# EAGLE design 9mm_mount (EAGLE 7.5.0)
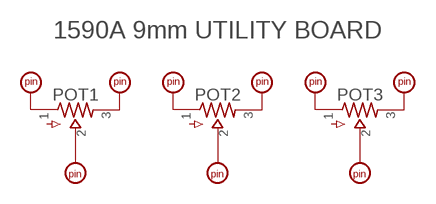
[diagram p0: schematic, sheet 1]

## Parts
PAD1  PAD  [UNLABELED]
PAD2  PAD  [UNLABELED]
PAD3  PAD  [UNLABELED]
PAD4  PAD  [UNLABELED]
PAD5  PAD  [UNLABELED]
PAD6  PAD  [UNLABELED]
PAD7  PAD  [UNLABELED]
PAD8  PAD  [UNLABELED]
PAD9  PAD  [UNLABELED]
POT1  POTS9MM_VERT_ALT  [9MM_VERT_ALT]
POT2  POTS9MM_VERT_ALT  [9MM_VERT_ALT]
POT3  POTS9MM_VERT_ALT  [9MM_VERT_ALT]

## Nets
N$1: PAD1.P$1 POT1.1
N$2: PAD2.P$1 POT1.3
N$3: PAD3.P$1 POT2.1
N$4: PAD4.P$1 POT2.3
N$5: PAD5.P$1 POT3.1
N$6: PAD6.P$1 POT3.3
N$7: PAD7.P$1 POT1.2
N$8: PAD8.P$1 POT2.2
N$9: PAD9.P$1 POT3.2

## Notes on the sheet
- 1590A 9mm UTILITY BOARD

## Library data of the parts
PAD1-PAD9 = supply pins:PAD
POT1-POT3 = potentiometers:POTS

## Board
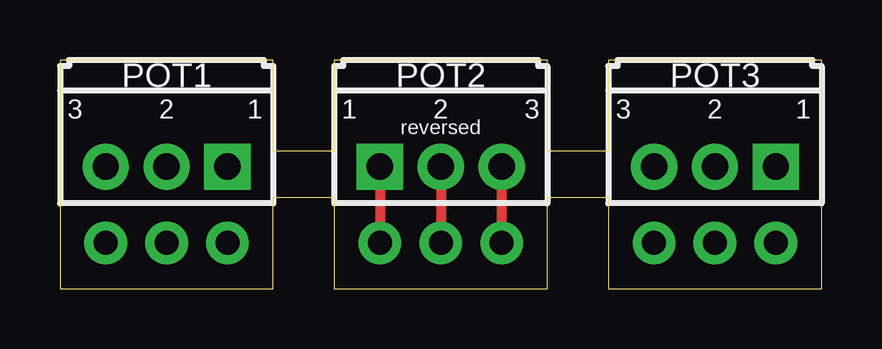
[diagram p1: board, top side]
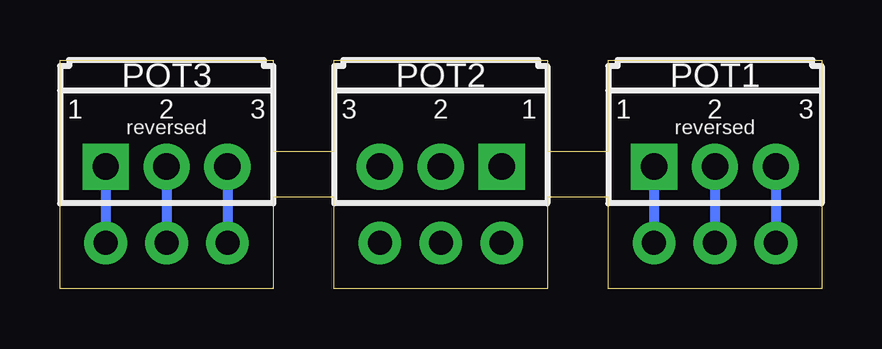
[diagram p2: board, bottom side, seen from below]

Size 31.75 x 9.53 mm. Coordinates in mm from the lower left corner, seen from the top.
Outline: 0,0 8.89,0 8.89,3.81 11.43,3.81 11.43,0 20.32,0 20.32,3.81 22.86,3.81 22.86,0 31.75,0 31.75,9.53 22.86,9.53 22.86,5.71 20.32,5.71 20.32,9.53 11.43,9.53 11.43,5.71 8.89,5.71 8.89,9.53 0,9.53 0,0
Copper layers (1*16): Top 0.0356mm / dielectric 1.5011mm / Bottom 0.0356mm
Design rules "oshpark-2layer": minimum track width 6mil, minimum drill 13mil, track to track 6mil, track to pad 6mil, pad to pad 6mil, via to via 6mil, smd to smd 6mil, copper to edge 15mil, drill to drill 6mil, minimum pad ring 7mil, minimum via ring 7mil, stop-mask expansion 2.5mil, vias tented up to drill 0mil, thermal gap 10mil

### Footprints (pad centres in the part's own frame; a part is rotated, then mirrored left to right if it is on the bottom)
UNLABELED = drill 1 pad 1.778: P$1 0,0
9MM_VERT_ALT = drill 1.1 pad 1.93 square: 1 2.54,0 | drill 1.1 pad 1.93: 2 0,0; 3 -2.54,0

### Placement (x,y rotation side)
PAD1  6.99,1.91 0 top
PAD2  1.91,1.91 0 top
PAD3  13.34,1.91 0 top
PAD4  18.41,1.91 0 top
PAD5  29.84,1.91 0 top
PAD6  24.77,1.91 0 top
PAD7  4.45,1.91 0 top
PAD8  15.88,1.91 0 top
PAD9  27.3,1.91 0 top
POT1  4.45,5.08 0 top
POT2  15.88,5.08 0 bottom
POT3  27.3,5.08 0 top

### Tracks (layer width: path | path; a pad name or v marks a point on that pad's centre or on a via)
N$1
  Bottom 0.406: POT1.1 PAD1.P$1
N$2
  Bottom 0.406: POT1.3 PAD2.P$1
N$3
  Top 0.406: POT2.1 PAD3.P$1
N$4
  Top 0.406: POT2.3 PAD4.P$1
N$5
  Bottom 0.406: POT3.1 PAD5.P$1
N$6
  Bottom 0.406: POT3.3 PAD6.P$1
N$7
  Bottom 0.406: POT1.2 PAD7.P$1
N$8
  Top 0.406: POT2.2 PAD8.P$1
N$9
  Bottom 0.406: POT3.2 PAD9.P$1